# Altium schematic sheet FIT_TCM_SFP_PLUS.SchDoc: FIT_PM12 board
size 420 x 297 mm; CheckedBy: G.Kasprowicz; Author: INR Moscow; CompanyName: WUT ISE; DrawnBy: M.Podgórski; Organization: WUT ISE; Address1: PW ISE; Address2: Nowowiejska 15/19 00-665 Warsaw; Address3: gkasprow@gmail.com; Revision: 2; SheetNumber: -; SheetTotal: -; ModifiedBy: -; CheckedDate: -; Title2: Title 2; DivGrp: WUT ISE; Designer: INR RAS; ModifiedDate: -; ProjectName: Sensor Box
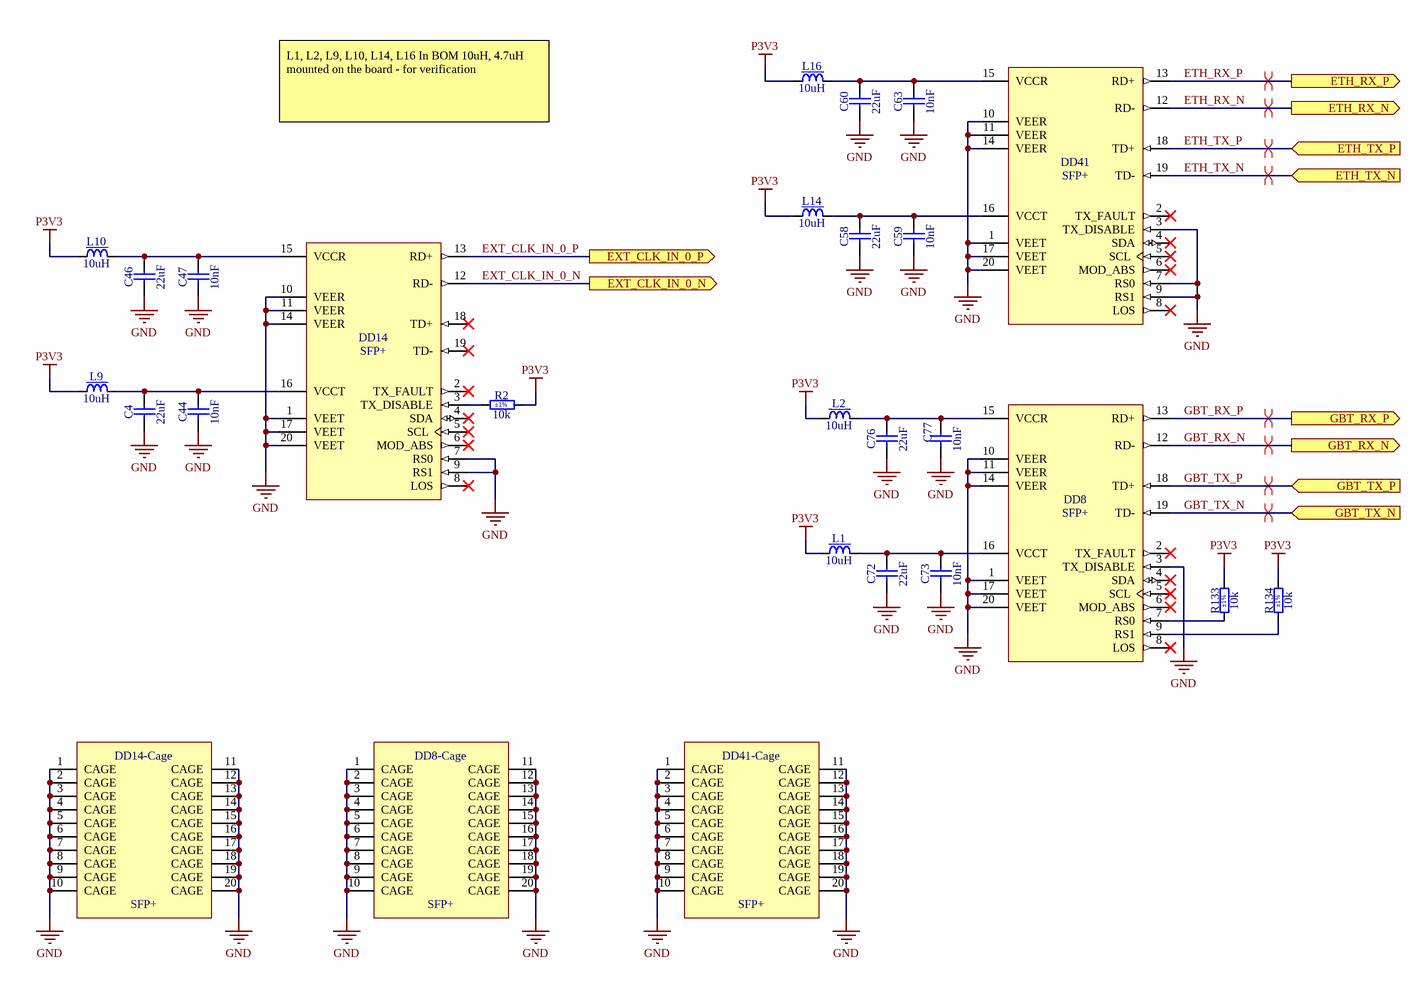
[diagram p0: FIT_TCM_SFP_PLUS.SchDoc]

## Parts
C4  22uF  [CAPC3216X180N]
C44  10nF  [CAPC2012X135N]
C46  22uF  [CAPC3216X180N]
C47  10nF  [CAPC2012X135N]
C58  22uF  [CAPC3216X180N]
C59  10nF  [CAPC2012X135N]
C60  22uF  [CAPC3216X180N]
C63  10nF  [CAPC2012X135N]
C72  22uF  [CAPC3216X180N]
C73  10nF  [CAPC2012X135N]
C76  22uF  [CAPC3216X180N]
C77  10nF  [CAPC2012X135N]
DD8  SFP+  [AMPHENOL_UE76A203000]
DD8-Cage  SFP+  [AMPHENOL_U77A16131001]
DD14  SFP+  [AMPHENOL_UE76A203000]
DD14-Cage  SFP+  [AMPHENOL_U77A16131001]
DD41  SFP+  [AMPHENOL_UE76A203000]
DD41-Cage  SFP+  [AMPHENOL_U77A16131001]
L1  10uH  [INDM5552X200N]
L2  10uH  [INDM5552X200N]
L9  10uH  [INDM5552X200N]
L10  10uH  [INDM5552X200N]
L14  10uH  [INDM5552X200N]
L16  10uH  [INDM5552X200N]
R2  10k  Tolerance: ±1%  [RESC2012X60N]
R133  10k  Tolerance: ±1%  [RESC2012X60N]
R134  10k  Tolerance: ±1%  [RESC2012X60N]

## Ports
ETH_RX_N (out), ETH_RX_P (out), ETH_TX_N (in), ETH_TX_P (in), EXT_CLK_IN_0_N (out), EXT_CLK_IN_0_P (out), GBT_RX_N (out), GBT_RX_P (out), GBT_TX_N (in), GBT_TX_P (in)

## Nets
GND: C4.1 C44.1 C46.1 C47.1 C58.1 C59.1 C60.1 C63.1 C72.1 C73.1 C76.1 C77.1 DD8.1(VEET) DD8.3(TX_DISABLE) DD8.10(VEER) DD8.11(VEER) DD8.14(VEER) DD8.17(VEET) DD8.20(VEET) DD8-Cage.1(CAGE) DD8-Cage.2(CAGE) DD8-Cage.3(CAGE) DD8-Cage.4(CAGE) DD8-Cage.5(CAGE) DD8-Cage.6(CAGE) DD8-Cage.7(CAGE) DD8-Cage.8(CAGE) DD8-Cage.9(CAGE) DD8-Cage.10(CAGE) DD8-Cage.11(CAGE) DD8-Cage.12(CAGE) DD8-Cage.13(CAGE) DD8-Cage.14(CAGE) DD8-Cage.15(CAGE) DD8-Cage.16(CAGE) DD8-Cage.17(CAGE) DD8-Cage.18(CAGE) DD8-Cage.19(CAGE) DD8-Cage.20(CAGE) DD14.1(VEET) DD14.7(RS0) DD14.9(RS1) DD14.10(VEER) DD14.11(VEER) DD14.14(VEER) DD14.17(VEET) DD14.20(VEET) DD14-Cage.1(CAGE) DD14-Cage.2(CAGE) DD14-Cage.3(CAGE) DD14-Cage.4(CAGE) DD14-Cage.5(CAGE) DD14-Cage.6(CAGE) DD14-Cage.7(CAGE) DD14-Cage.8(CAGE) DD14-Cage.9(CAGE) DD14-Cage.10(CAGE) DD14-Cage.11(CAGE) DD14-Cage.12(CAGE) DD14-Cage.13(CAGE) DD14-Cage.14(CAGE) DD14-Cage.15(CAGE) DD14-Cage.16(CAGE) DD14-Cage.17(CAGE) DD14-Cage.18(CAGE) DD14-Cage.19(CAGE) DD14-Cage.20(CAGE) DD41.1(VEET) DD41.3(TX_DISABLE) DD41.7(RS0) DD41.9(RS1) DD41.10(VEER) DD41.11(VEER) DD41.14(VEER) DD41.17(VEET) DD41.20(VEET) DD41-Cage.1(CAGE) DD41-Cage.2(CAGE) DD41-Cage.3(CAGE) DD41-Cage.4(CAGE) DD41-Cage.5(CAGE) DD41-Cage.6(CAGE) DD41-Cage.7(CAGE) DD41-Cage.8(CAGE) DD41-Cage.9(CAGE) DD41-Cage.10(CAGE) DD41-Cage.11(CAGE) DD41-Cage.12(CAGE) DD41-Cage.13(CAGE) DD41-Cage.14(CAGE) DD41-Cage.15(CAGE) DD41-Cage.16(CAGE) DD41-Cage.17(CAGE) DD41-Cage.18(CAGE) DD41-Cage.19(CAGE) DD41-Cage.20(CAGE)
P3V3: L1.1 L2.1 L9.1 L10.1 L14.1 L16.1 R2.2 R133.2 R134.2
ETH_RX_N: DD41.12(RD-) ; port ETH_RX_N
ETH_RX_P: DD41.13(RD+) ; port ETH_RX_P
ETH_TX_N: DD41.19(TD-) ; port ETH_TX_N
ETH_TX_P: DD41.18(TD+) ; port ETH_TX_P
EXT_CLK_IN_0_N: DD14.12(RD-) ; port EXT_CLK_IN_0_N
EXT_CLK_IN_0_P: DD14.13(RD+) ; port EXT_CLK_IN_0_P
GBT_RX_N: DD8.12(RD-) ; port GBT_RX_N
GBT_RX_P: DD8.13(RD+) ; port GBT_RX_P
GBT_TX_N: DD8.19(TD-) ; port GBT_TX_N
GBT_TX_P: DD8.18(TD+) ; port GBT_TX_P
NetC4_2: C4.2 C44.2 DD14.16(VCCT) L9.2
NetC46_2: C46.2 C47.2 DD14.15(VCCR) L10.2
NetC58_2: C58.2 C59.2 DD41.16(VCCT) L14.2
NetC60_2: C60.2 C63.2 DD41.15(VCCR) L16.2
NetC72_2: C72.2 C73.2 DD8.16(VCCT) L1.2
NetC76_2: C76.2 C77.2 DD8.15(VCCR) L2.2
NetDD8_7: DD8.7(RS0) R133.1
NetDD8_9: DD8.9(RS1) R134.1
NetDD14_3: DD14.3(TX_DISABLE) R2.1

Not connected (* = marked no-connect by the designer): DD8 2(TX_FAULT)* 4(SDA)* 5(SCL)* 6(MOD_ABS)* 8(LOS)*; DD14 2(TX_FAULT)* 4(SDA)* 5(SCL)* 6(MOD_ABS)* 8(LOS)* 18(TD+)* 19(TD-)*; DD41 2(TX_FAULT)* 4(SDA)* 5(SCL)* 6(MOD_ABS)* 8(LOS)*

## Layout directives
differential pair: ETH_RX_N, ETH_RX_P, ETH_TX_N, ETH_TX_P, GBT_RX_N, GBT_RX_P, GBT_TX_N, GBT_TX_P

## Notes on the sheet
- L1, L2, L9, L10, L14, L16 In BOM 10uH, 4.7uH mounted on the board - for verification
- Project/Equipment
- Document
- Designer
- Drawn by
- Check.by
- Copyright WUT ISE 2024.
  This documentation describes Open Hardware and is licensed under the CERN OHL v.2. You may redistribute and modify this documentation under the terms of the CERN OHL v.2. (http://ohwr.org/CERNOHL). This documentation is distributed WITHOUT ANY EXPRESS OR IMPLIED WARRANTY, INCLUDING OF MERCHANTABILITY, SATISFACTORY QUALITY AND FITNESS FOR A PARTICULAR PURPOSE. Please see the CERN OHL v.2 for applicable conditions.
- Contact
- File
- Last Mod.
- Print Date
- Sheet
- Size
- A3
- of
- Rev

## Library data of the parts
C4 C46 C58 C60 C72 C76 = CC1206_22UF_25V_20%_X5R: Non-polarised capacitor; Part Description: SMD Multilayer Chip Ceramic Capacitor; Manufacturer: GENERIC; Manufacturer1 Part Number: C3216X5R1E226M160; Voltage: 25V; TC: X5R; Tolerance: ±20%; Part Number: CC1206_22UF_25V_20%_X5R; Component Kind: Standard; Component Type: Standard; Pin Count: 2; Value: 22uF; Status: None; Manufacturer Part Number: CC1206_22UF_25V_20%_X5R; Case: 1206; Mounted: Yes; Socket: No; SMD: Yes; Sense: No; Manufacturer1 Example: TDK; Manufacturer1 ComponentHeight: 1.8mm; HelpURL: \\cern.ch\dfs\Applications\Altium\Datasheets\CC1206_X5R_TDK_C.pdf; Author: CERN DEM WB; CreateDate: 25.07.2018; LatestRevisionDate: 25.07.2018
C44 C47 C59 C63 C73 C77 = CC0805_10NF_50V_10%_X7R: Non-polarised capacitor; Part Description: SMD Multilayer Chip Ceramic Capacitor; Manufacturer: GENERIC; Manufacturer1 Part Number: C0805C103K5RACTU; Voltage: 50V; TC: X7R; Tolerance: ±10%; Part Number: CC0805_10NF_50V_10%_X7R; Component Kind: Standard; Component Type: Standard; Pin Count: 2; Value: 10nF; Status: Preferred; Manufacturer Part Number: CC0805_10NF_50V_10%_X7R; Case: 0805; Mounted: Yes; Socket: No; SMD: Yes; Sense: No; Manufacturer1 Example: KEMET; Manufacturer1 ComponentHeight: 0.88mm; HelpURL: \\cern.ch\dfs\Applications\Altium\Datasheets\CC0805_X7R_KEMET.pdf; Author: CERN DEM JLC; CreateDate: 03.12.2007; LatestRevisionDate: 22.04.2015
DD8 DD14 DD41 = AMPHENOL_UE76A203000: 20 Position SFP+ Connector (Small Form-factor Pluggable); Part Description: 20 Position, Pitch 0.8mm SFP+ High Speed Connector Receptacle (Small Form-factor Pluggable); PressFit: No; Part Number: AMPHENOL_UE76A203000; Component Kind: Standard; Component Type: Standard; Pin Count: 20; Family: SFP+; Mounted: Yes; Socket: No; SMD: Yes; Sense: No; Status: None; Manufacturer: AMPHENOL; Manufacturer Part Number: UE76A203000; ComponentHeight: 5.25mm; HelpURL: \\cern.ch\dfs\Applications\Altium\Datasheets\AMPHENOL_UE76A203000.pdf; Author: CERN DEM BC; CreateDate: 04.09.2020; LatestRevisionDate: 04.09.2020
DD8-Cage DD14-Cage DD41-Cage = AMPHENOL_U77A16131001: SFP+ 1x1 Cage (20Pins); Part Description: 1x1 Cage For Use with SFP+ Connector (Small Form-factor Pluggable); PressFit: No; Part Number: AMPHENOL_U77A16131001; Component Kind: Standard; Component Type: Standard; Pin Count: 20; Family: SFP+; Mounted: Yes; Socket: No; SMD: No; Sense: No; Status: None; Manufacturer: AMPHENOL; Manufacturer Part Number: U77A16131001; ComponentHeight: 9.7mm; HelpURL: \\cern.ch\dfs\Applications\Altium\Datasheets\AMPHENOL_U77A16131001.pdf; Author: CERN DEM BC; CreateDate: 03.09.2020; LatestRevisionDate: 03.09.2020
L1 L2 L9 L10 L14 L16 = IND2020_10UH_20%_VISHAY_IHLP-2020BZ-11: Inductor With Core; Part Description: Low Profile, High Current IHLP® Inductor; Manufacturer: VISHAY DALE; Manufacturer Part Number: IHLP2020BZER100M11; Power: 2.2A; Resistance: 0.1828R; Tolerance: ±20%; Part Number: IND2020_10UH_20%_VISHAY_IHLP-2020BZ-11; Component Kind: Standard; Component Type: Standard; Pin Count: 2; Value: 10uH; Case: 2020; Mounted: Yes; Socket: No; SMD: Yes; Sense: No; ComponentHeight: 2mm; HelpURL: \\cern.ch\dfs\Applications\Altium\Datasheets\IND2020_VISHAY_IHLP2020BZ-11.pdf; Author: CERN DEM HF; CreateDate: 31.05.2024; LatestRevisionDate: 31.05.2024
R2 R133 R134 = R0805_10K_1%_0.125W_100PPM: Resistor - 1%; Part Description: General Purpose Thick Film Chip Resistor; Manufacturer: GENERIC; Manufacturer1 Part Number: NRC10F1002TRF; Power: 0.125W; TC: ±100ppm/°C; PressFit: No; Part Number: R0805_10K_1%_0.125W_100PPM; Component Kind: Standard; Component Type: Standard; Pin Count: 2; Value: 10k; Status: Preferred; Manufacturer Part Number: R0805_10K_1%_0.125W_100PPM; Case: 0805; Mounted: Yes; Sense: No; Socket: No; SMD: Yes; Manufacturer1 Example: NIC COMPONENT; Manufacturer1 ComponentHeight: 0.6mm; HelpURL: \\cern.ch\dfs\Applications\Altium\Datasheets\R0805_NIC_NRC.pdf; Author: CERN DEM JLC; CreateDate: 03.12.2007; LatestRevisionDate: 13.03.2008